# Altium project ShemaTPAS.PrjPcb
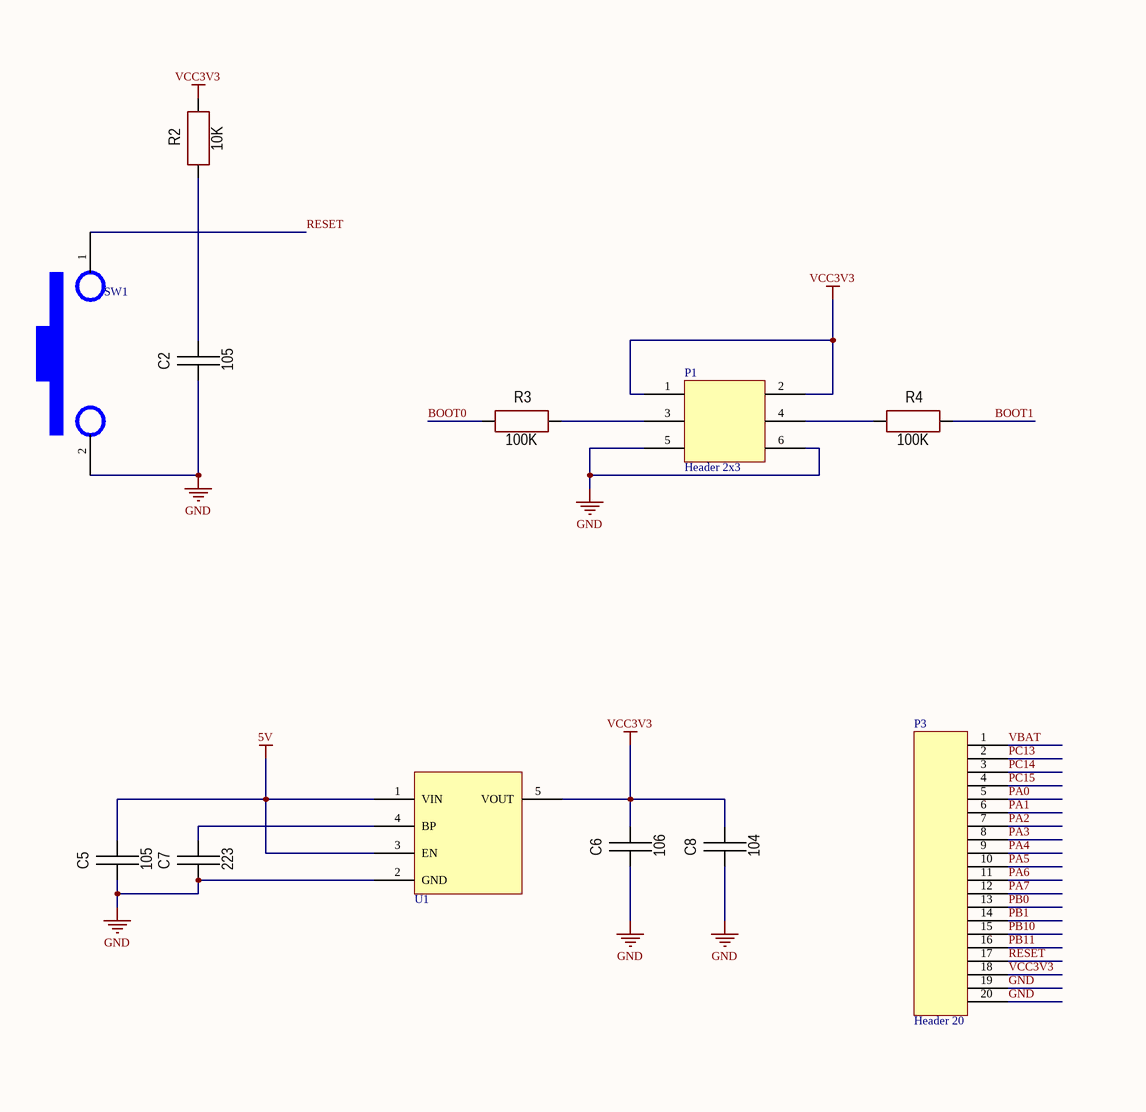
[diagram p0: Sheet1.SchDoc, top left]
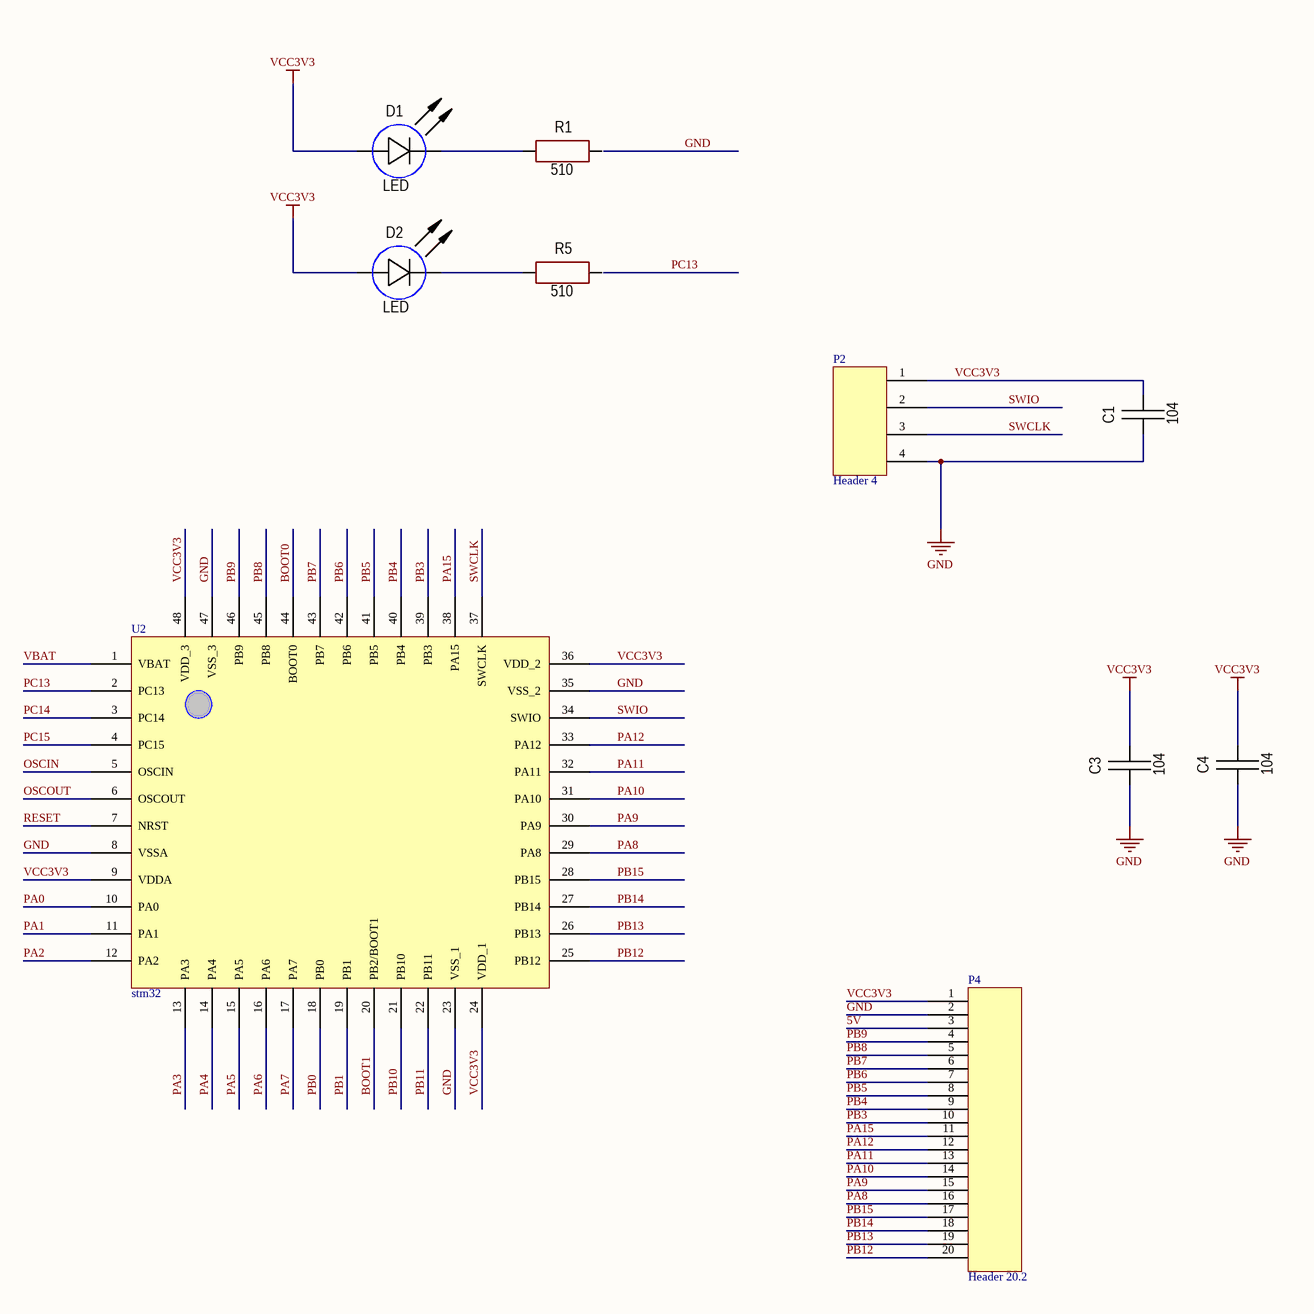
[diagram p1: Sheet1.SchDoc, top right]
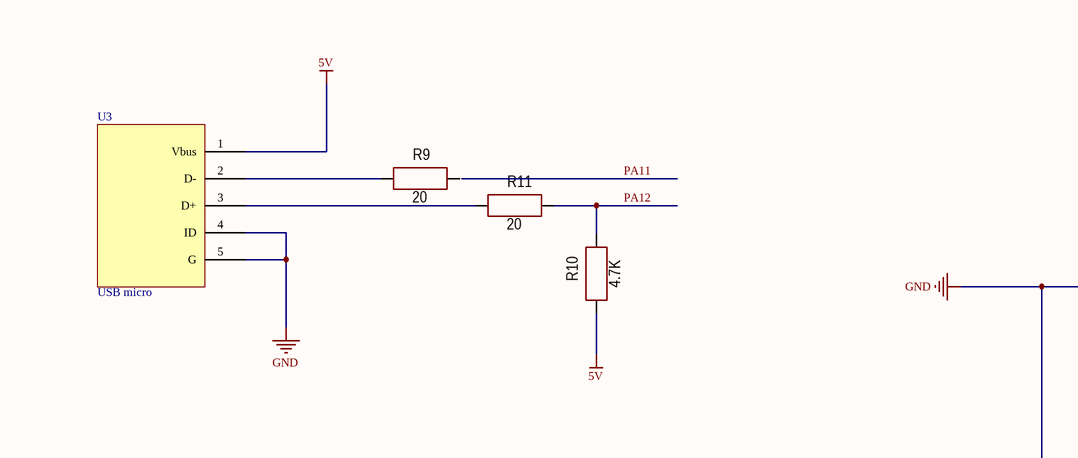
[diagram p2: Sheet1.SchDoc, bottom left]
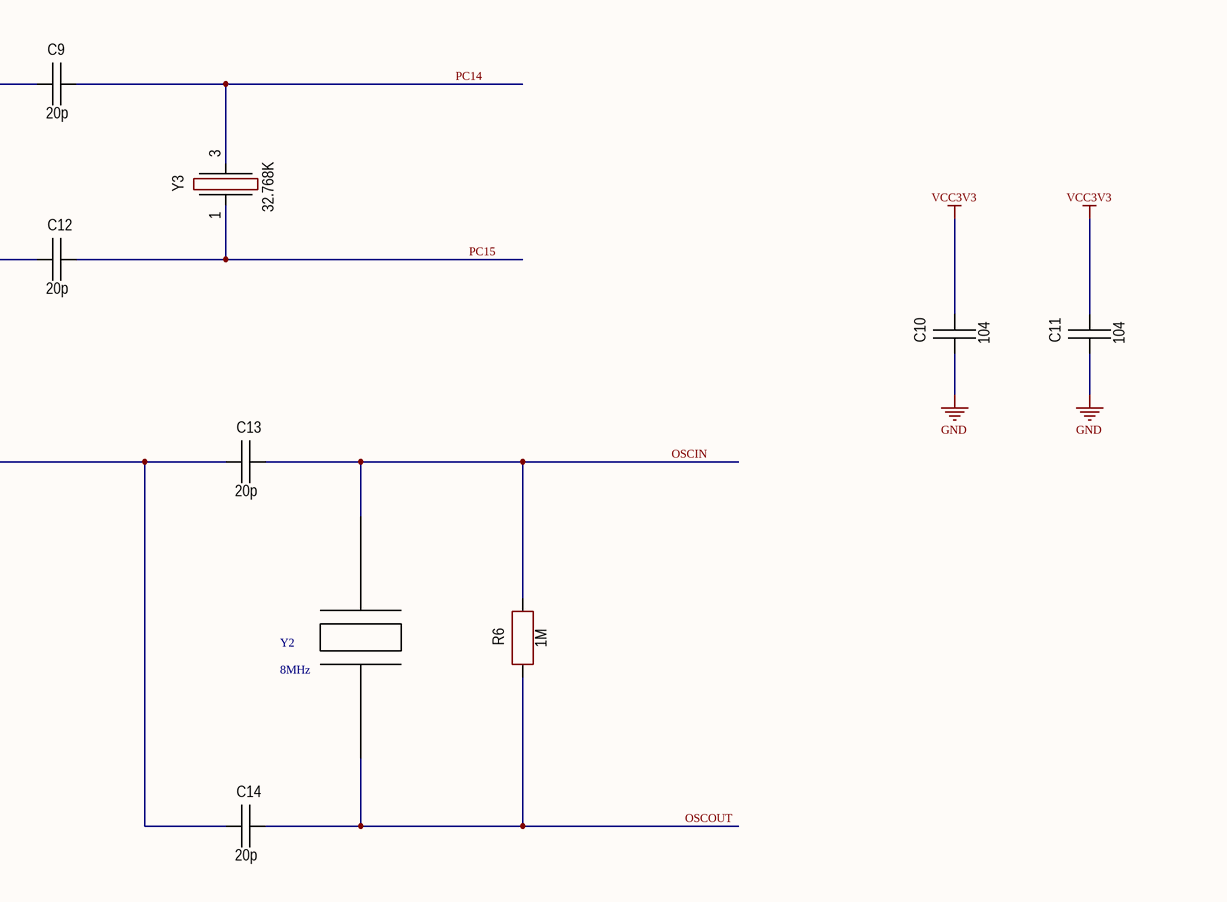
[diagram p3: Sheet1.SchDoc, bottom right]
1 sheet, 35 parts. Net scope: global (net labels, ports and power ports of the same name join across sheets).
Board file: PCB1.PcbDoc

## Sheet Sheet1.SchDoc
size A1

### Parts
C1  104  [CH0603C]
C2  105  [CH0603C]
C3  104  [CH0603C]
C4  104  [CH0603C]
C5  105  [CH0603C]
C6  106  [CH0603C]
C7  223  [CH0603C]
C8  104  [CH0603C]
C9  20p  [CH0603C]
C10  104  [CH0603C]
C11  104  [CH0603C]
C12  20p  [CH0603C]
C13  20p  [CH0603C]
C14  20p  [CH0603C]
D1  LED  [CH0603LB]
D2  LED  [CH0603LR]
P1  Header 2x3  [Header 3X2]
P2  Header 4  [header 4]
P3  Header 20  [Header 20]
P4  Header 20.2  [Header 20]
R1  510  [CH0603R]
R2  10K  [CH0603R]
R3  100K  [CH0603R]
R4  100K  [CH0603R]
R5  510  [CH0603R]
R6  1M  [CH0603R]
R9  20  [CH0603R]
R10  4.7K  [CH0603R]
R11  20  [CH0603R]
SW1  Switch  [Switch]  (value not drawn)
U1  Regulator  [MIC5205-3.3YM5-TR]  (value not drawn)
U2  stm32  [STM32F103C8T6]
U3  USB micro  [USB MICRO]
Y2  8MHz  [HC49]
Y3  32.768K  [OSC: 3215]

### Nets
5V: C5.2 P4.3 R10.1 U1.1(VIN) U1.3(EN) U3.1(Vbus)
GND: C1.1 C2.1 C3.1 C4.1 C5.1 C6.1 C7.1 C8.1 C9.1 C10.1 C11.1 C12.1 C13.1 C14.1 P1.5 P1.6 P2.4 P3.19 P3.20 P4.2 SW1.2 U1.2(GND) U2.8(VSSA) U2.23(VSS_1) U2.35(VSS_2) U2.47(VSS_3) U3.4(ID) U3.5(G)
VCC3V3: C1.2 C3.2 C4.2 C8.2 C11.2 D1.1(A) D2.1(A) P1.1 P1.2 P2.1 P3.18 P4.1 R2.2 U1.5(VOUT) U2.9(VDDA) U2.24(VDD_1) U2.36(VDD_2) U2.48(VDD_3)
BOOT0: R3.1 U2.44(BOOT0)
BOOT1: R4.2 U2.20(PB2/BOOT1)
OSCIN: R6.2 U2.5(OSCIN) Y2.2
OSCOUT: C14.2 R6.1 U2.6(OSCOUT) Y2.1
PA0: P3.5 U2.10(PA0)
PA1: P3.6 U2.11(PA1)
PA2: P3.7 U2.12(PA2)
PA3: P3.8 U2.13(PA3)
PA4: P3.9 U2.14(PA4)
PA5: P3.10 U2.15(PA5)
PA6: P3.11 U2.16(PA6)
PA7: P3.12 U2.17(PA7)
PA8: P4.16 U2.29(PA8)
PA9: P4.15 U2.30(PA9)
PA10: P4.14 U2.31(PA10)
PA11: P4.13 U2.32(PA11)
PA12: P4.12 R10.2 R11.2 U2.33(PA12)
PA15: P4.11 U2.38(PA15)
PB0: P3.13 U2.18(PB0)
PB1: P3.14 U2.19(PB1)
PB3: P4.10 U2.39(PB3)
PB4: P4.9 U2.40(PB4)
PB5: P4.8 U2.41(PB5)
PB6: P4.7 U2.42(PB6)
PB7: P4.6 U2.43(PB7)
PB8: P4.5 U2.45(PB8)
PB9: P4.4 U2.46(PB9)
PB10: P3.15 U2.21(PB10)
PB11: P3.16 U2.22(PB11)
PB12: P4.20 U2.25(PB12)
PB13: P4.19 U2.26(PB13)
PB14: P4.18 U2.27(PB14)
PB15: P4.17 U2.28(PB15)
PC13: P3.2 U2.2(PC13)
PC14: C9.2 P3.3 U2.3(PC14) Y3.3
PC15: C12.2 P3.4 U2.4(PC15) Y3.1
RESET: P3.17 SW1.1 U2.7(NRST)
SWCLK: P2.3 U2.37(SWCLK)
SWIO: P2.2 U2.34(SWIO)
VBAT: P3.1 U2.1(VBAT)
NetC2_2: C2.2 R2.1
NetC7_2: C7.2 U1.4(BP)
NetD1_2: D1.2(C) R1.1
NetD2_2: D2.2(C) R5.1
NetP1_3: P1.3 R3.2
NetP1_4: P1.4 R4.1
NetR9_1: R9.1 U3.2(D-)
NetR11_1: R11.1 U3.3(D+)

Not connected (* = marked no-connect by the designer): C6 2; C10 2; C13 2; R1 2; R5 2; R9 2

### Library data of the parts
C1-C14 = Capacitor: Manufacturer: *; Model: *; HelpURL: *; ComponentKind: *; Value: *
P4 = Header 20
R1-R6 R9-R11 = Resistor: Manufacturer: *; Model: *; HelpURL: *; ComponentKind: *; Value: *
Y2 Y3 = Oscillator
  Y3: Manufacturer: *; Model: *; HelpURL: *; ComponentKind: *; Value: *
D1 D2 = LED: Manufacturer: *; Model: *; HelpURL: *; ComponentKind: *; Value: *